# Altium project Preamp.PrjPcb
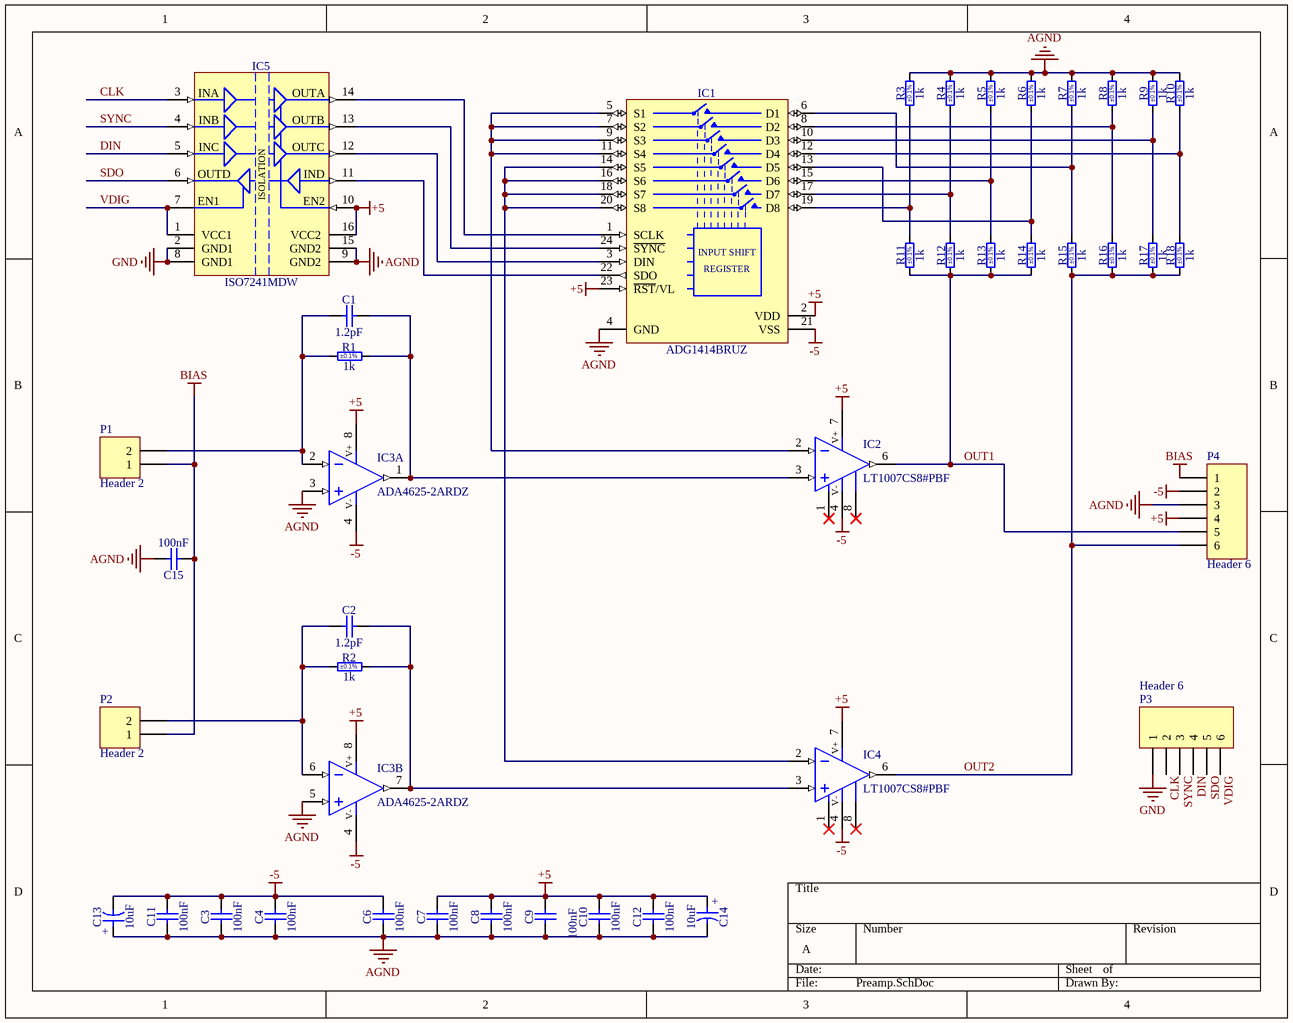
[diagram p0: Preamp.SchDoc]
1 sheet, 41 parts. Net scope: global (net labels, ports and power ports of the same name join across sheets).
Board file: Preamp.PcbDoc

## Sheet Preamp.SchDoc
size A

### Parts
C1  1.2pF  [CAPC1608X87N]
C2  1.2pF  [CAPC1608X87N]
C3  100nF  [CAPC2012X135N]
C4  100nF  [CAPC2012X135N]
C6  100nF  [CAPC2012X135N]
C7  100nF  [CAPC2012X135N]
C8  100nF  [CAPC2012X135N]
C9  100nF  [CAPC2012X135N]
C10  100nF  [CAPC2012X135N]
C11  100nF  [CAPC2012X135N]
C12  100nF  [CAPC2012X135N]
C13  10uF  [CAPMP7343X310N]
C14  10uF  [CAPMP7343X310N]
C15  100nF  [CAPC2012X135N]
IC1  ADG1414BRUZ  [SOP65P640X120-24N]
IC2  LT1007CS8#PBF  [SOIC127P600X175-8N]
IC3  ADA4625-2ARDZ  [SOIC127P600X175-9N-S229]  (parts A,B of 2)
IC4  LT1007CS8#PBF  [SOIC127P600X175-8N]
IC5  ISO7241MDW  [SOIC127P1030X265-16N]
P1  Header 2  [HDR1X2]
P2  Header 2  [HDR1X2]
P3  Header 6  [HDR1X6]
P4  Header 6  [HDR1X6]
R1  1k  Tolerance: ±0.1%  [RESC2012X60N]
R2  1k  Tolerance: ±0.1%  [RESC2012X60N]
R3  1k  Tolerance: ±0.1%  [RESC2012X60N]
R4  1k  Tolerance: ±0.1%  [RESC2012X60N]
R5  1k  Tolerance: ±0.1%  [RESC2012X60N]
R6  1k  Tolerance: ±0.1%  [RESC2012X60N]
R7  1k  Tolerance: ±0.1%  [RESC2012X60N]
R8  1k  Tolerance: ±0.1%  [RESC2012X60N]
R9  1k  Tolerance: ±0.1%  [RESC2012X60N]
R10  1k  Tolerance: ±0.1%  [RESC2012X60N]
R11  1k  Tolerance: ±0.1%  [RESC2012X60N]
R12  1k  Tolerance: ±0.1%  [RESC2012X60N]
R13  1k  Tolerance: ±0.1%  [RESC2012X60N]
R14  1k  Tolerance: ±0.1%  [RESC2012X60N]
R15  1k  Tolerance: ±0.1%  [RESC2012X60N]
R16  1k  Tolerance: ±0.1%  [RESC2012X60N]
R17  1k  Tolerance: ±0.1%  [RESC2012X60N]
R18  1k  Tolerance: ±0.1%  [RESC2012X60N]

### Nets
+5: C7.2 C8.2 C9.2 C10.2 C12.2 C14.1 IC1.2(VDD) IC1.23(~{RST}/VL) IC2.7(V+) IC3.8(V+) IC4.7(V+) IC5.10(EN2) IC5.16(VCC2) P4.4
-5: C3.2 C4.2 C6.2 C11.2 C13.2 IC1.21(VSS) IC2.4(V-) IC3.4(V-) IC4.4(V-) P4.2
AGND: C3.1 C4.1 C6.1 C7.1 C8.1 C9.1 C10.1 C11.1 C12.1 C13.1 C14.2 C15.2 IC1.4(GND) IC3.3(IN+) IC3.5(IN+) IC5.9(GND2) IC5.15(GND2) P4.3 R3.2 R4.2 R5.2 R6.2 R7.2 R8.2 R9.2 R10.2
BIAS: C15.1 P1.1 P2.1 P4.1
GND: IC5.2(GND1) IC5.8(GND1) P3.1
CLK: IC5.3(INA) P3.2
DIN: IC5.5(INC) P3.4
OUT1: IC2.6(OUT) P4.5 R11.1 R12.1 R13.1 R14.1
OUT2: IC4.6(OUT) P4.6 R15.1 R16.1 R17.1 R18.1
SDO: IC5.6(IND) P3.5
SYNC: IC5.4(INB) P3.3
VDIG: IC5.1(VCC1) IC5.7(EN1) P3.6
NetC1_1: C1.1 IC3.2(IN-) P1.2 R1.1
NetC1_2: C1.2 IC2.3(IN+) IC3.1(OUT) R1.2
NetC2_1: C2.1 IC3.6(IN-) P2.2 R2.1
NetC2_2: C2.2 IC3.7(OUT) IC4.3(IN+) R2.2
NetIC1_1: IC1.1(SCLK) IC5.14(OUTA)
NetIC1_3: IC1.3(DIN) IC5.12(OUTC)
NetIC1_5: IC1.5(S1) IC1.7(S2) IC1.9(S3) IC1.11(S4) IC2.2(IN-)
NetIC1_6: IC1.6(D1) R7.1 R15.2
NetIC1_8: IC1.8(D2) R8.1 R16.2
NetIC1_10: IC1.10(D3) R9.1 R17.2
NetIC1_12: IC1.12(D4) R10.1 R18.2
NetIC1_13: IC1.13(D5) R6.1 R14.2
NetIC1_14: IC1.14(S5) IC1.16(S6) IC1.18(S7) IC1.20(S8) IC4.2(IN-)
NetIC1_15: IC1.15(D6) R5.1 R13.2
NetIC1_17: IC1.17(D7) R4.1 R12.2
NetIC1_19: IC1.19(D8) R3.1 R11.2
NetIC1_22: IC1.22(SDO) IC5.11(OUTD)
NetIC1_24: IC1.24(~{SYNC}) IC5.13(OUTB)

Not connected (* = marked no-connect by the designer): IC2 1(OFFSET)* 8(OFFSET)*; IC4 1(OFFSET)* 8(OFFSET)*

### Notes on the sheet
- (in symbol ADG1414BRUZ) INPUT SHIFT; REGISTER
- (in symbol CTE7343-31_10UF_25V_10%) +
- (in symbol ISO7241MDW) ISOLATION

### Library data of the parts
C1 C2 = CC0603_1.2PF_50V_0.25PF_NP0: Non-polarised capacitor; Part Description: SMD Multilayer Chip Ceramic Capacitor; Manufacturer: GENERIC; Manufacturer1 Part Number: 223886715128; Voltage: 50V; TC: C0G/NP0; Tolerance: ±0.25pF; Part Number: CC0603_1.2PF_50V_0.25PF_NP0; Component Kind: Standard; Component Type: Standard; Pin Count: 2; Value: 1.2pF; Status: Preferred; Manufacturer Part Number: CC0603_1.2PF_50V_0.25PF_NP0; Case: 0603; Mounted: Yes; Socket: No; SMD: Yes; Sense: No; Manufacturer1 Example: PHYCOMP; Manufacturer1 ComponentHeight: 0.87mm; HelpURL: \\cern.ch\dfs\Applications\Altium\Datasheets\CC0603_NP0_PHYCOMP.pdf; Author: CERN DEM JLC; CreateDate: 12/3/2007; LatestRevisionDate: 12/3/2007
C3 C4 C6-C12 C15 = CC0805_100NF_50V_10%_X7R: Non-polarised capacitor; Part Description: SMD Multilayer Chip Ceramic Capacitor; Manufacturer: GENERIC; Manufacturer1 Part Number: C2012X7R1H104K085AA; Voltage: 50V; TC: X7R; Tolerance: ±10%; Part Number: CC0805_100NF_50V_10%_X7R; Component Kind: Standard; Component Type: Standard; Pin Count: 2; Value: 100nF; Status: Preferred; Manufacturer Part Number: CC0805_100NF_50V_10%_X7R; Case: 0805; Mounted: Yes; Socket: No; SMD: Yes; Sense: No; Manufacturer1 Example: TDK; Manufacturer1 ComponentHeight: 1mm; HelpURL: \\cern.ch\dfs\Applications\Altium\Datasheets\CC0805_X7R_TDK_C.pdf; Author: CERN DEM JLC; CreateDate: 12/3/2007; LatestRevisionDate: 4/22/2015
C13 C14 = CTE7343-31_10UF_25V_10%: Polarised capacitor; Part Description: Solid Tantalum Chip Capacitor; Manufacturer: GENERIC; Manufacturer1 Part Number: TAJD106K025R; Voltage: 25V; Tolerance: ±10%; Part Number: CTE7343-31_10UF_25V_10%; Component Kind: Standard; Component Type: Standard; Pin Count: 2; Value: 10uF; Status: Preferred; Manufacturer Part Number: CTE7343-31_10UF_25V_10%; Case: D; Mounted: Yes; Socket: No; SMD: Yes; Sense: No; Manufacturer1 Example: AVX; Manufacturer1 ComponentHeight: 3.1mm; HelpURL: \\cern.ch\dfs\Applications\Altium\Datasheets\CTE_AVX_TAJ.pdf; Author: CERN DEM JMW; CreateDate: 10/17/2008; LatestRevisionDate: 10/17/2008
IC1 = ADG1414BRUZ: 9.5 Ohm ON Resistance, ±15 V/+12 V/±5 V iCMOS,  Serially-Controlled Octal SPST Switches; Manufacturer: ANALOG DEVICES; PressFit: No; Bonding: No; Part Number: ADG1414BRUZ; Component Kind: Standard; Component Type: Standard; Device: ADG1414BRUZ; PackageDescription: SOP, 0.65mm Pitch; 24 Pin, 4.40mm W X 7.80mm L X 1.20mm H body, IPC Medium Density; Part Description: 9.5 Ohm ON Resistance, ±15 V/+12 V/±5 V iCMOS,  Serially-Controlled Octal SPST Switches; Manufacturer Part Number: ADG1414BRUZ; Pin Count: 24; Case: TSSOP24; Mounted: Yes; Socket: No; SMD: Yes; Sense: No; ComponentHeight: 1.2mm; Author: CERN DEM MR; HelpURL: \\cern.ch\dfs\Applications\Altium\Datasheets\ADG1414BRUZ.pdf; CreateDate: 10/21/2016; LatestRevisionDate: 10/21/2016
IC2 IC4 = LT1007CS8#PBF: Operational Amplifier with Offset 1-8; Part Description: Low Noise, High Speed Precision Operational Amplifier; Manufacturer: LINEAR TECHNOLOGY; PressFit: No; Bonding: No; Part Number: LT1007CS8#PBF; Component Kind: Standard; Component Type: Standard; Device: LT1007CS8#PBF; PackageDescription: SOIC 8, Pitch 1.27mm - Body 4x5mm, IPC Medium Density; Manufacturer Part Number: LT1007CS8#PBF; Pin Count: 7; Case: SOIC8; Mounted: Yes; Socket: No; SMD: Yes; Sense: No; ComponentHeight: 1.75mm; Author: CERN DEM JLC; HelpURL: \\cern.ch\dfs\Applications\Altium\Datasheets\LT1007CS8#PBF.pdf; CreateDate: 3/9/2011; LatestRevisionDate: 3/9/2011
IC3 = ADA4625-2ARDZ: Dual Operational Amplifier; Part Description: Dual, 36V, 18MHz, Low Noise, Fast Settling, Single Supply, RRO, JFET Operational Amplifier; Manufacturer: ANALOG DEVICES; PressFit: No; Bonding: No; Part Number: ADA4625-2ARDZ; Component Kind: Standard; Component Type: Standard; Device: ADA4625-2ARDZ; PackageDescription: SOIC, 1.27mm Pitch; 8 Pin, 3.90mm W X 4.90mm L X 1.75mm H body (w/Thermal Tab 2.29 X 2.29mm), IPC Medium Density; Manufacturer Part Number: ADA4625-2ARDZ; Pin Count: 8; Case: SOIC8; Mounted: Yes; Socket: No; SMD: Yes; Sense: No; ComponentHeight: 1.75mm; Author: CERN DEM BC; HelpURL: \\cern.ch\dfs\Applications\Altium\Datasheets\ADA4625-2ARDZ.pdf; CreateDate: 10/22/2019; LatestRevisionDate: 10/22/2019
IC5 = ISO7241MDW: Quad Channel, 150Mbps, Digital Isolator; Part Description: Quad Channel (3/1 Channel Directionality), 150Mbps, Digital Isolator; Manufacturer: TEXAS INSTRUMENTS; PressFit: No; Bonding: No; Part Number: ISO7241MDW; Component Kind: Standard; Component Type: Standard; Device: ISO7241MDW; PackageDescription: SOIC, 1.27mm Pitch; 16 Pin, 7.50mm W X 10.3mm L X 2.65mm H body, IPC Medium Density; Manufacturer Part Number: ISO7241MDW; Pin Count: 16; Case: SOIC16W; Mounted: Yes; Socket: No; SMD: Yes; Sense: No; ComponentHeight: 2.65mm; Author: CERN DEM BC; HelpURL: \\cern.ch\dfs\Applications\Altium\Datasheets\ISO7241MDW.pdf; CreateDate: 3/9/2020; LatestRevisionDate: 3/9/2020
P1 P2 = Header 2: Header, 2-Pin; LatestRevisionDate: 17-Jul-2002; LatestRevisionNote: Re-released for DXP Platform.; Publisher: Altium Limited
P3 P4 = Header 6: Header, 6-Pin; LatestRevisionDate: 17-Jul-2002; LatestRevisionNote: Re-released for DXP Platform.; Publisher: Altium Limited
R1-R18 = R0805_1K_0.1%_0.1W_10PPM: Resistor - 0.1%; Part Description: Thin Film Chip Resistor; Manufacturer: GENERIC; Manufacturer1 Part Number: RN73C2A1K0BTG; Power: 0.1W; TC: ±10ppm; PressFit: No; Part Number: R0805_1K_0.1%_0.1W_10PPM; Component Kind: Standard; Component Type: Standard; Pin Count: 2; Value: 1k; Status: Not Recommended; Manufacturer Part Number: R0805_1K_0.1%_0.1W_10PPM; Case: 0805; Mounted: Yes; Sense: No; Socket: No; SMD: Yes; Manufacturer1 Example: TYCO HOLSWORTHY; Manufacturer1 ComponentHeight: 0.6mm; HelpURL: \\cern.ch\dfs\Applications\Altium\Datasheets\R0805_TYCO_RN73.pdf; Author: CERN DEM JLC; CreateDate: 5/28/2013; LatestRevisionDate: 5/28/2013